# Altium schematic sheet LSM6DSO_ACCELERO.SchDoc: Shipwars Accelero Schematic
size 431 x 279 mm; CheckedBy: SP, PS; Author: SP, PS; CompanyName: UPenn; DrawnBy: SP, PS; Engineer: SP, PS; Organization: UPenn; Address1: 200 S 33rd Street; Address2: Detkin Lab; Address3: Philadelphia; Address4: PA 19104; Revision: .1.0.0; SheetNumber: 9; SheetTotal: 10; Project: Shipwars
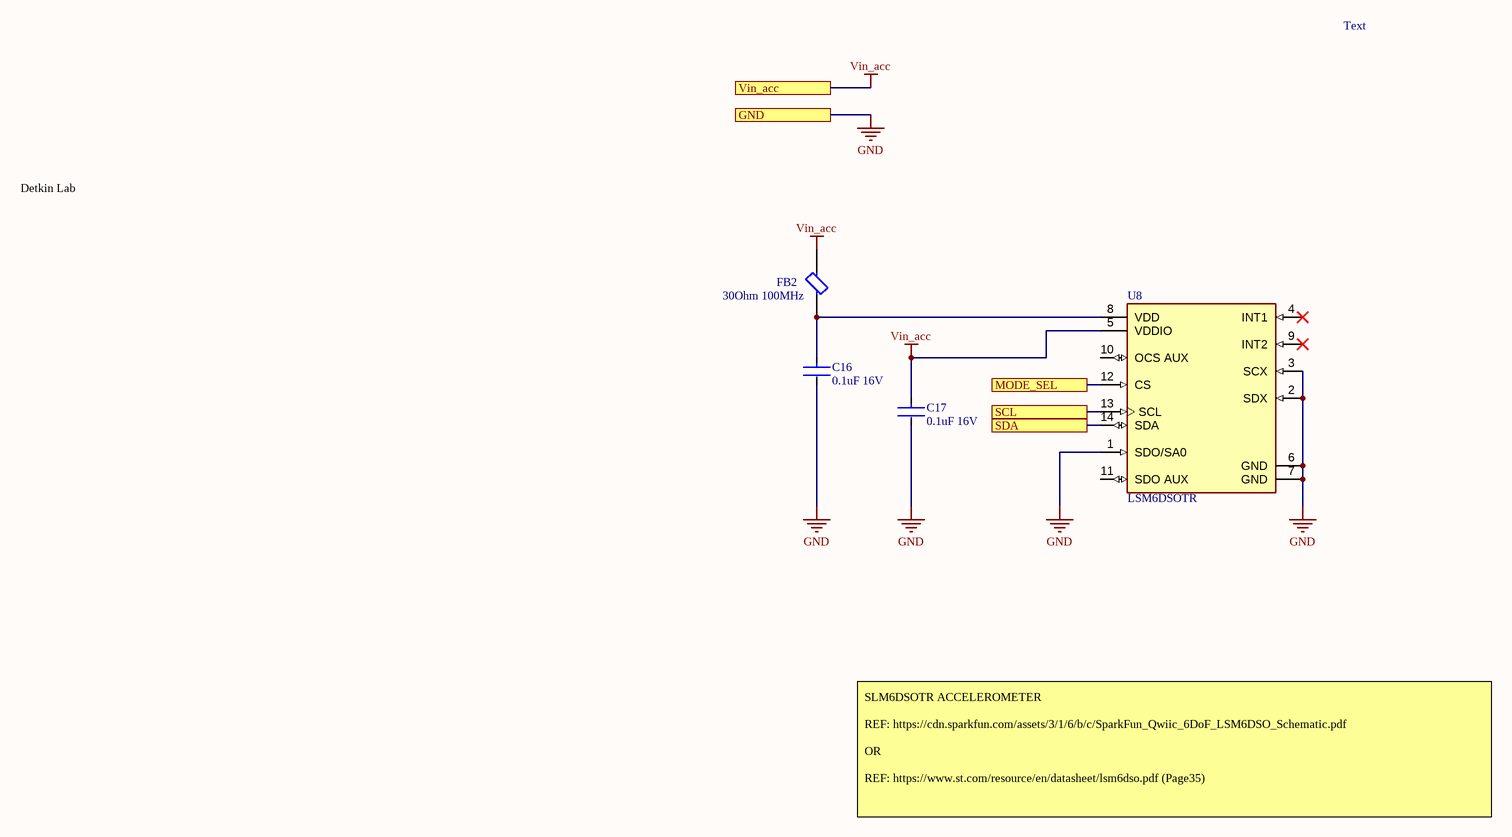
[diagram p0: LSM6DSO_ACCELERO.SchDoc]

## Parts
C16  0.1uF 16V  [FP-CC0402-MFG]
C17  0.1uF 16V  [FP-CC0402-MFG]
FB2  30Ohm 100MHz  [FP-MPZ1608-MFG]
U8  LSM6DSOTR  [FP-LGA-14L-DM00249496-MFG]

## Ports
GND, MODE_SEL, SCL, SDA, Vin_acc

## Nets
GND: C16.2 C17.2 U8.1(SDO/SA0) U8.2(SDX) U8.3(SCX) U8.6(GND) U8.7(GND) ; port GND
Vin_acc: C17.1 FB2.2 U8.5(VDDIO) ; port Vin_acc
MODE_SEL: U8.12(CS) ; port MODE_SEL
SCL: U8.13(SCL) ; port SCL
SDA: U8.14(SDA) ; port SDA
NetC16_1: C16.1 FB2.1 U8.8(VDD)

Not connected (* = marked no-connect by the designer): U8 4(INT1)* 9(INT2)* 10(OCS_AUX) 11(SDO_AUX)

## Notes on the sheet
- Text
- Detkin Lab
- SLM6DSOTR ACCELEROMETER
  REF: https://cdn.sparkfun.com/assets/3/1/6/b/c/SparkFun_Qwiic_6DoF_LSM6DSO_Schematic.pdf
  OR
  REF: https://www.st.com/resource/en/datasheet/lsm6dso.pdf (Page35)
- DWG. NO.
- REV.
- SHT.
- THIS DOCUMENT AND THE DATA DISCLOSED HEREIN OR HEREWITH IS THE PROPERTY OF ALTIUM LIMITED AND MAY BE FREELY DISTRIBUTED IN WHOLE. NO RIGHTS ARE RESERVED OR EXPRESS OR IMPLIED WARANTEE GIVEN.
- REVISION
- DESCRIPTION
- DATE
- APPROVED
- ENG:
- APPROVALS
- PROJECT
- DSN:
- CHK:
- REFERENCE DOCUMENTS
- PROJECT REVISION:
- TITLE
- DOCUMENT REVISION:
- DESIGN ITEM:
- BOM:
- FAB DWG:
- PCB DWG:
- ASSY DWG:
- SCALE:
- SIZE
- B
- CAGE CODE
- FILE NAME
- DWG NO.
- SHEET
- OF
- REV

## Library data of the parts
C16 C17 = CMP-03422-000048-1: CAP CER 0.1UF 16V X7R 0402; Manufacturer: YAGEO; Manufacturer Part Number: CC0402KRX7R7BB104; Material: Ceramic; Automotive Grade: NA; Capacitance: 100 nF; Temperature Coefficient: 30ppm/°C; Tolerance: 0.1; Value: 100 nF; Device Class L1: Passive Components; Temperature Range Low: -55°C; Device Class L3: Ceramic Capacitors; Temperature Characteristic: X7R; Ipc Land Pattern Name: CAPC10050X50; Temperature Range High: +125°C; Voltage Rating: 16 V; Temperature: -55°C to +125°C; RoHS: TRUE; Automotive: No; Height: 0.55mm; Device Class L2: Capacitors; Digikey Description: CAP CER 0.1UF 16V X7R 0402; Package: CC0402; Footprint Url: http://www.yageo.com/exep/pages/download/literatures/UPY-C_GEN_24.pdf; ComponentLink2Description: Datasheet; Category: Cap; Lead Free: Yes; Octopart: https://octopart.com/cc0402krx7r7bb104-yageo-42244624; ComponentLink2URL: http://www.yageo.com/documents/recent/UPY-GP_NP0_16V-to-50V_16.pdf; Mouser Description: 0402 0.1 uF 16 V ±10 % Tolerance X7R SMT Multilayer Ceramic Capacitor
FB2 = CMP-08257-000002-1: FERRITE BEAD 30 OHM 0603 1LN; Manufacturer: TDK; Manufacturer Part Number: MPZ1608S300ATAH0; Series Resistance: 0.01Ω; Rms Current: 5A; Tolerance: 10%; Impedance At Frequency: 30Ω @ 100MHz; Category: FBead; Device Class L3: Ferrite Beads and Chips; Device Class L1: Passive Components; Height: 0.75mm; Temperature Range High: +125°C; ComponentLink2Description: Datasheet; Automotive: No; Temperature: -55°C to +125°C; Octopart: https://octopart.com/mpz1608s300atah0-tdk-12062606; Ipc Land Pattern Name: CAPC16080X60; Lead Free: Yes; Device Class L2: EMI / RFI Components; RoHS: TRUE; Temperature Range Low: -55°C; Digikey Description: FERRITE BEAD 30 OHM 0603 1LN; ComponentLink2URL: https://product.tdk.com/info/en/catalog/datasheets/beads_commercial_power_mpz1608_en.pdf; Mouser Description: Ferrite Beads 30ohms 5A 10mOhms 0603 Ferrite Chip; Package: MPZ1608
U8 = CMP-12177-000012-1: INEMO INERTIAL MODULE: 3D ACCELE; Manufacturer: STMicroelectronics; Gyro Range: 125/250/500/1000/2000°/s; Max Supply Voltage: 3.6V; Sensor Output: I2C,SPI; Operating Supply Current: 0.55mA; Accel Range: 2/4/8/16g; Min Supply Voltage: 1.62V; Sensor Type: Temperature,Accelerometer,Gyroscope; Height: 0.86mm; Automotive: No; Device Class L3: Inertial Measurement Units (IMUs); Device Class L1: Sensors; ComponentLink2Description: Datasheet; Device Class L2: Motion Sensors; Temperature: -40°C to +85°C; Package: LGA-14L-DM00249496; Octopart: https://octopart.com/lsm6dsotr-stmicroelectronics-81706672; Temperature Range Low: -40°C; Digikey Description: CONSUMER MEMS; ComponentLink2URL: https://www.st.com/resource/en/datasheet/lsm6dso.pdf; Manufacturer Part Number: LSM6DSOTR; Footprint Url: https://www.st.com/content/ccc/resource/technical/document/technical_note/73/17/9c/16/dd/96/4a/01/CD00134799.pdf/files/CD00134799.pdf/jcr:content/translations/en.CD00134799.pdf; Lead Free: Yes; RoHS: TRUE; Category: IC; Temperature Range High: +85°C